# Altium schematic sheet FCStellarisSCH.SchDoc
size A4
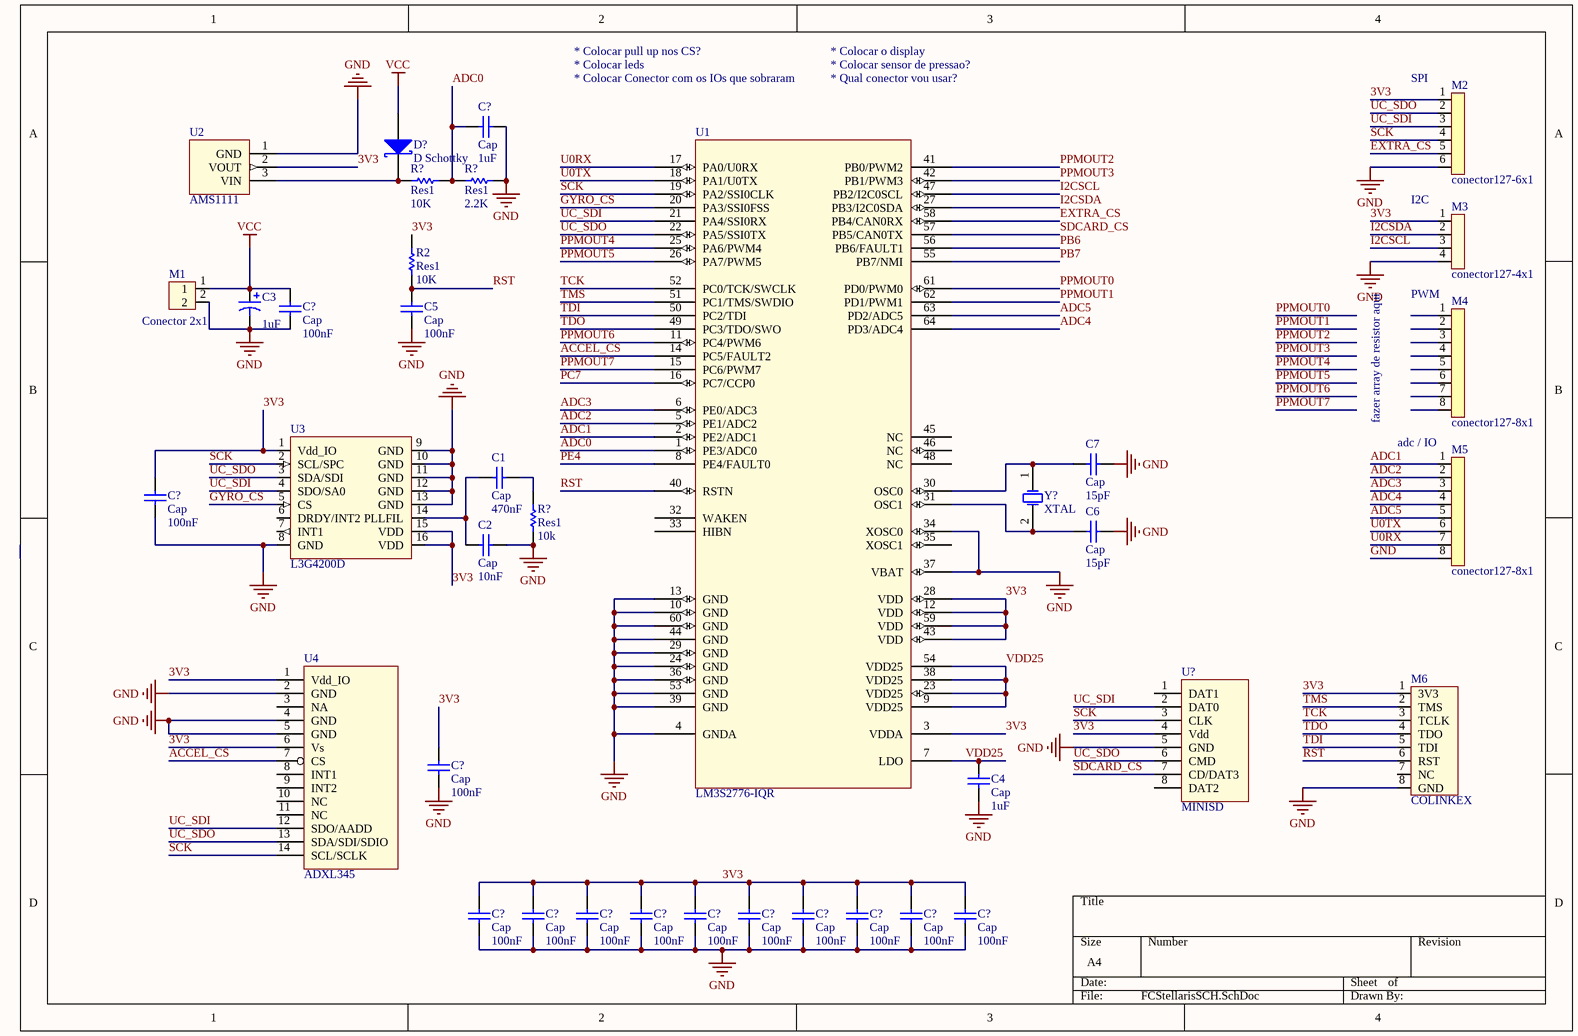
[diagram p0: FCStellarisSCH.SchDoc]

## Parts
(Parts that share a designator on the sheet are numbered #1, #2 ... from top to bottom, then left to right.)
C1  Cap  value 470nF  [Capacitor 0805]
C2  Cap  value 10nF  [Capacitor 0805]
C3  value 1uF  [C0805]  (hidden comment: Cap Pol3)
C4  Cap  value 1uF  [Capacitor 0805]
C5  Cap  value 100nF  [RAD-0.3]
C6  Cap  value 15pF  [RAD-0.3]
C7  Cap  value 15pF  [RAD-0.3]
C?#1  Cap  value 1uF  [RAD-0.3]
C?#2  Cap  value 100nF  [RAD-0.3]
C?#3  Cap  value 100nF  [RAD-0.3]
C?#4  Cap  value 100nF  [RAD-0.3]
C?#5  Cap  value 100nF  [RAD-0.3]
C?#6  Cap  value 100nF  [RAD-0.3]
C?#7  Cap  value 100nF  [RAD-0.3]
C?#8  Cap  value 100nF  [RAD-0.3]
C?#9  Cap  value 100nF  [RAD-0.3]
C?#10  Cap  value 100nF  [RAD-0.3]
C?#11  Cap  value 100nF  [RAD-0.3]
C?#12  Cap  value 100nF  [RAD-0.3]
C?#13  Cap  value 100nF  [RAD-0.3]
C?#14  Cap  value 100nF  [RAD-0.3]
D?  D Schottky  [SMB]
M1  Conector 2x1  [Con256M2x1]
M2  conector127-6x1
M3  conector127-4x1
M4  conector127-8x1
M5  conector127-8x1
M6  COLINKEX
R2  Res1  value 10K  [AXIAL-0.3]
R?#1  Res1  value 10K  [AXIAL-0.3]
R?#2  Res1  value 2.2K  [AXIAL-0.3]
R?#3  Res1  value 10k  [Capacitor 0805]
U1  LM3S2776-IQR  [QFP50P1200X1200X160-64N]
U2  AMS1111  [AMS1111]
U3  L3G4200D  [LGA16]
U4  ADXL345  [QFN80P500X300X80-14N]
U?  MINISD
Y?  XTAL  [R38]

## Nets
GND: C2.2 C3.2 C4.2 C5.2 C6.2 C7.2 C?#1.2 C?#2.2 C?#3.2 C?#4.2 C?#5.2 C?#6.2 C?#7.2 C?#8.2 C?#9.2 C?#10.2 C?#11.2 C?#12.2 C?#13.2 C?#14.2 M1.2 M2.6 M3.4 M5.8 M6.8(GND) R?#2.2 R?#3.2 U1.4(GNDA) U1.10(GND) U1.13(GND) U1.24(GND) U1.29(GND) U1.34(XOSC0) U1.36(GND) U1.37(VBAT) U1.39(GND) U1.44(GND) U1.53(GND) U1.60(GND) U2.1(GND) U3.8(GND) U3.9(GND) U3.10(GND) U3.11(GND) U3.12(GND) U3.13(GND) U4.2(GND) U4.4(GND) U4.5(GND) U?.5(GND)
VCC: C3.1 C?#2.1 D?.1(A) M1.1
3V3: C?#3.1 C?#4.1 C?#5.1 C?#6.1 C?#7.1 C?#8.1 C?#9.1 C?#10.1 C?#11.1 C?#12.1 C?#13.1 C?#14.1 M2.1 M3.1 M6.1(3V3) R2.1 U1.3(VDDA) U1.12(VDD) U1.28(VDD) U1.43(VDD) U1.59(VDD) U2.2(VOUT) U3.1(Vdd_IO) U3.15(VDD) U3.16(VDD) U4.1(Vdd_IO) U4.6(Vs) U?.4(Vdd)
ACCEL_CS: U1.14(PC5/FAULT2) U4.7(CS)
ADC0: C?#1.1 R?#1.2 R?#2.1 U1.1(PE3/ADC0)
ADC1: M5.1 U1.2(PE2/ADC1)
ADC2: M5.2 U1.5(PE1/ADC2)
ADC3: M5.3 U1.6(PE0/ADC3)
ADC4: M5.4 U1.64(PD3/ADC4)
ADC5: M5.5 U1.63(PD2/ADC5)
EXTRA_CS: M2.5 U1.58(PB4/CAN0RX)
GYRO_CS: U1.20(PA3/SSI0FSS) U3.5(CS)
I2CSCL: M3.3 U1.47(PB2/I2C0SCL)
I2CSDA: M3.2 U1.27(PB3/I2C0SDA)
PB6: U1.56(PB6/FAULT1)
PB7: U1.55(PB7/NMI)
PC7: U1.16(PC7/CCP0)
PE4: U1.8(PE4/FAULT0)
PPMOUT0: U1.61(PD0/PWM0)
PPMOUT1: U1.62(PD1/PWM1)
PPMOUT2: U1.41(PB0/PWM2)
PPMOUT3: U1.42(PB1/PWM3)
PPMOUT4: U1.25(PA6/PWM4)
PPMOUT5: U1.26(PA7/PWM5)
PPMOUT6: U1.11(PC4/PWM6)
PPMOUT7: U1.15(PC6/PWM7)
RST: C5.1 M6.6(RST) R2.2 U1.40(RSTN)
SCK: M2.4 U1.19(PA2/SSI0CLK) U3.2(SCL/SPC) U4.14(SCL/SCLK) U?.3(CLK)
SDCARD_CS: U1.57(PB5/CAN0TX) U?.7(CD/DAT3)
TCK: M6.3(TCLK) U1.52(PC0/TCK/SWCLK)
TDI: M6.5(TDI) U1.50(PC2/TDI)
TDO: M6.4(TDO) U1.49(PC3/TDO/SWO)
TMS: M6.2(TMS) U1.51(PC1/TMS/SWDIO)
U0RX: M5.7 U1.17(PA0/U0RX)
U0TX: M5.6 U1.18(PA1/U0TX)
UC_SDI: M2.3 U1.21(PA4/SSI0RX) U3.4(SDO/SA0) U4.12(SDO/AADD) U?.2(DAT0)
UC_SDO: M2.2 U1.22(PA5/SSI0TX) U3.3(SDA/SDI) U4.13(SDA/SDI/SDIO) U?.6(CMD)
VDD25: C4.1 U1.7(LDO) U1.9(VDD25) U1.23(VDD25) U1.38(VDD25) U1.54(VDD25)
NetC1_1: C1.1 C2.1 U3.14(PLLFIL)
NetC1_2: C1.2 R?#3.1
NetC6_1: C6.1 U1.31(OSC1) Y?.2(OSC2)
NetC7_1: C7.1 U1.30(OSC0) Y?.1(OSC1)
NetD?_2: D?.2(K) R?#1.1 U2.3(VIN)

Not connected (* = marked no-connect by the designer): M4 1 2 3 4 5 6 7 8; M6 7(NC); U1 32(WAKEN) 33(HIBN) 35(XOSC1) 45(NC) 46(NC) 48(NC); U3 6(DRDY/INT2) 7(INT1); U4 3(NA) 8(INT1) 9(INT2) 10(NC) 11(NC); U? 1(DAT1) 8(DAT2)

## Notes on the sheet
- * Colocar pull up nos CS?
- * Colocar leds
- * Colocar Conector com os IOs que sobraram
- * Colocar sensor de pressao?
- * Qual conector vou usar?
- * Colocar o display
- (near M2) SPI
- I2C
- PWM
- fazer array de resistor aqui
- (near M5) adc / IO

## Library data of the parts
C1 C2 C4-C7 C?#1-C?#14 = Cap: Capacitor; Published: 8-Jun-2000; LatestRevisionDate: 17-Jul-2002; LatestRevisionNote: Re-released for DXP Platform.; PackageReference: RAD-0.3; Publisher: Altium Limited; PackageDescription: Radial Cap, Thru-Hole; 2 Leads; 0.3 in Pin Spacing
C3 = Cap Pol3: Polarized Capacitor (Surface Mount); Published: 8-Jun-2000; LatestRevisionDate: 29-May-2009; LatestRevisionNote: IPC-7351 Footprint Added.; PackageReference: C0805; Publisher: Altium Limited; PackageDescription: Chip Capacitor
D? = D Schottky: Schottky Diode; Published: 8-Jun-2000; LatestRevisionDate: 17-Jul-2002; LatestRevisionNote: Re-released for DXP Platform.; PackageReference: SMB; Publisher: Altium Limited; PackageDescription: DO-214-AA/SMB; 2 C-Bend Leads; Body 5.3 x 3.6 mm, inc. leads (LxW); Code_JEDEC: DO-214-AA
M1 = conector254-2x1
M6 = JTAG_COLINKEX
R2 R?#1-R?#3 = Res1: Resistor; Published: 8-Jun-2000; LatestRevisionDate: 17-Jul-2002; LatestRevisionNote: Re-released for DXP Platform.; PackageReference: AXIAL-0.3; Publisher: Altium Limited; PackageDescription: Axial Device, Thru-Hole; 2 Leads; 0.3 in Pin Spacing
U1 = LM3S2776-IQR: Stellaris ARM Cortex-M3 Microcontroller; Manufacturer #1: Luminary Micro; LMI Class: Dust Devil; Designator: U; Part Number: LM3S2776-IQR; Comment_1: LM3S2776-IQR
U2 = AMS1111: 3.3V Linear Regulator
U3 = L3G4200D: Digital Gyroscope 3-axis
U? = MINI_SD
Y? = XTAL: Crystal Oscillator; Published: 8-Jun-2000; LatestRevisionDate: 17-Jul-2002; LatestRevisionNote: Re-released for DXP Platform.; PackageReference: R38; Publisher: Altium Limited; PackageDescription: Crystal, Thru-Hole; 2 Leads; Body 3.1 x 8.2 mm (Dia.xH)